# EAGLE design 23138_adapter_passive (EAGLE 9.5.2)
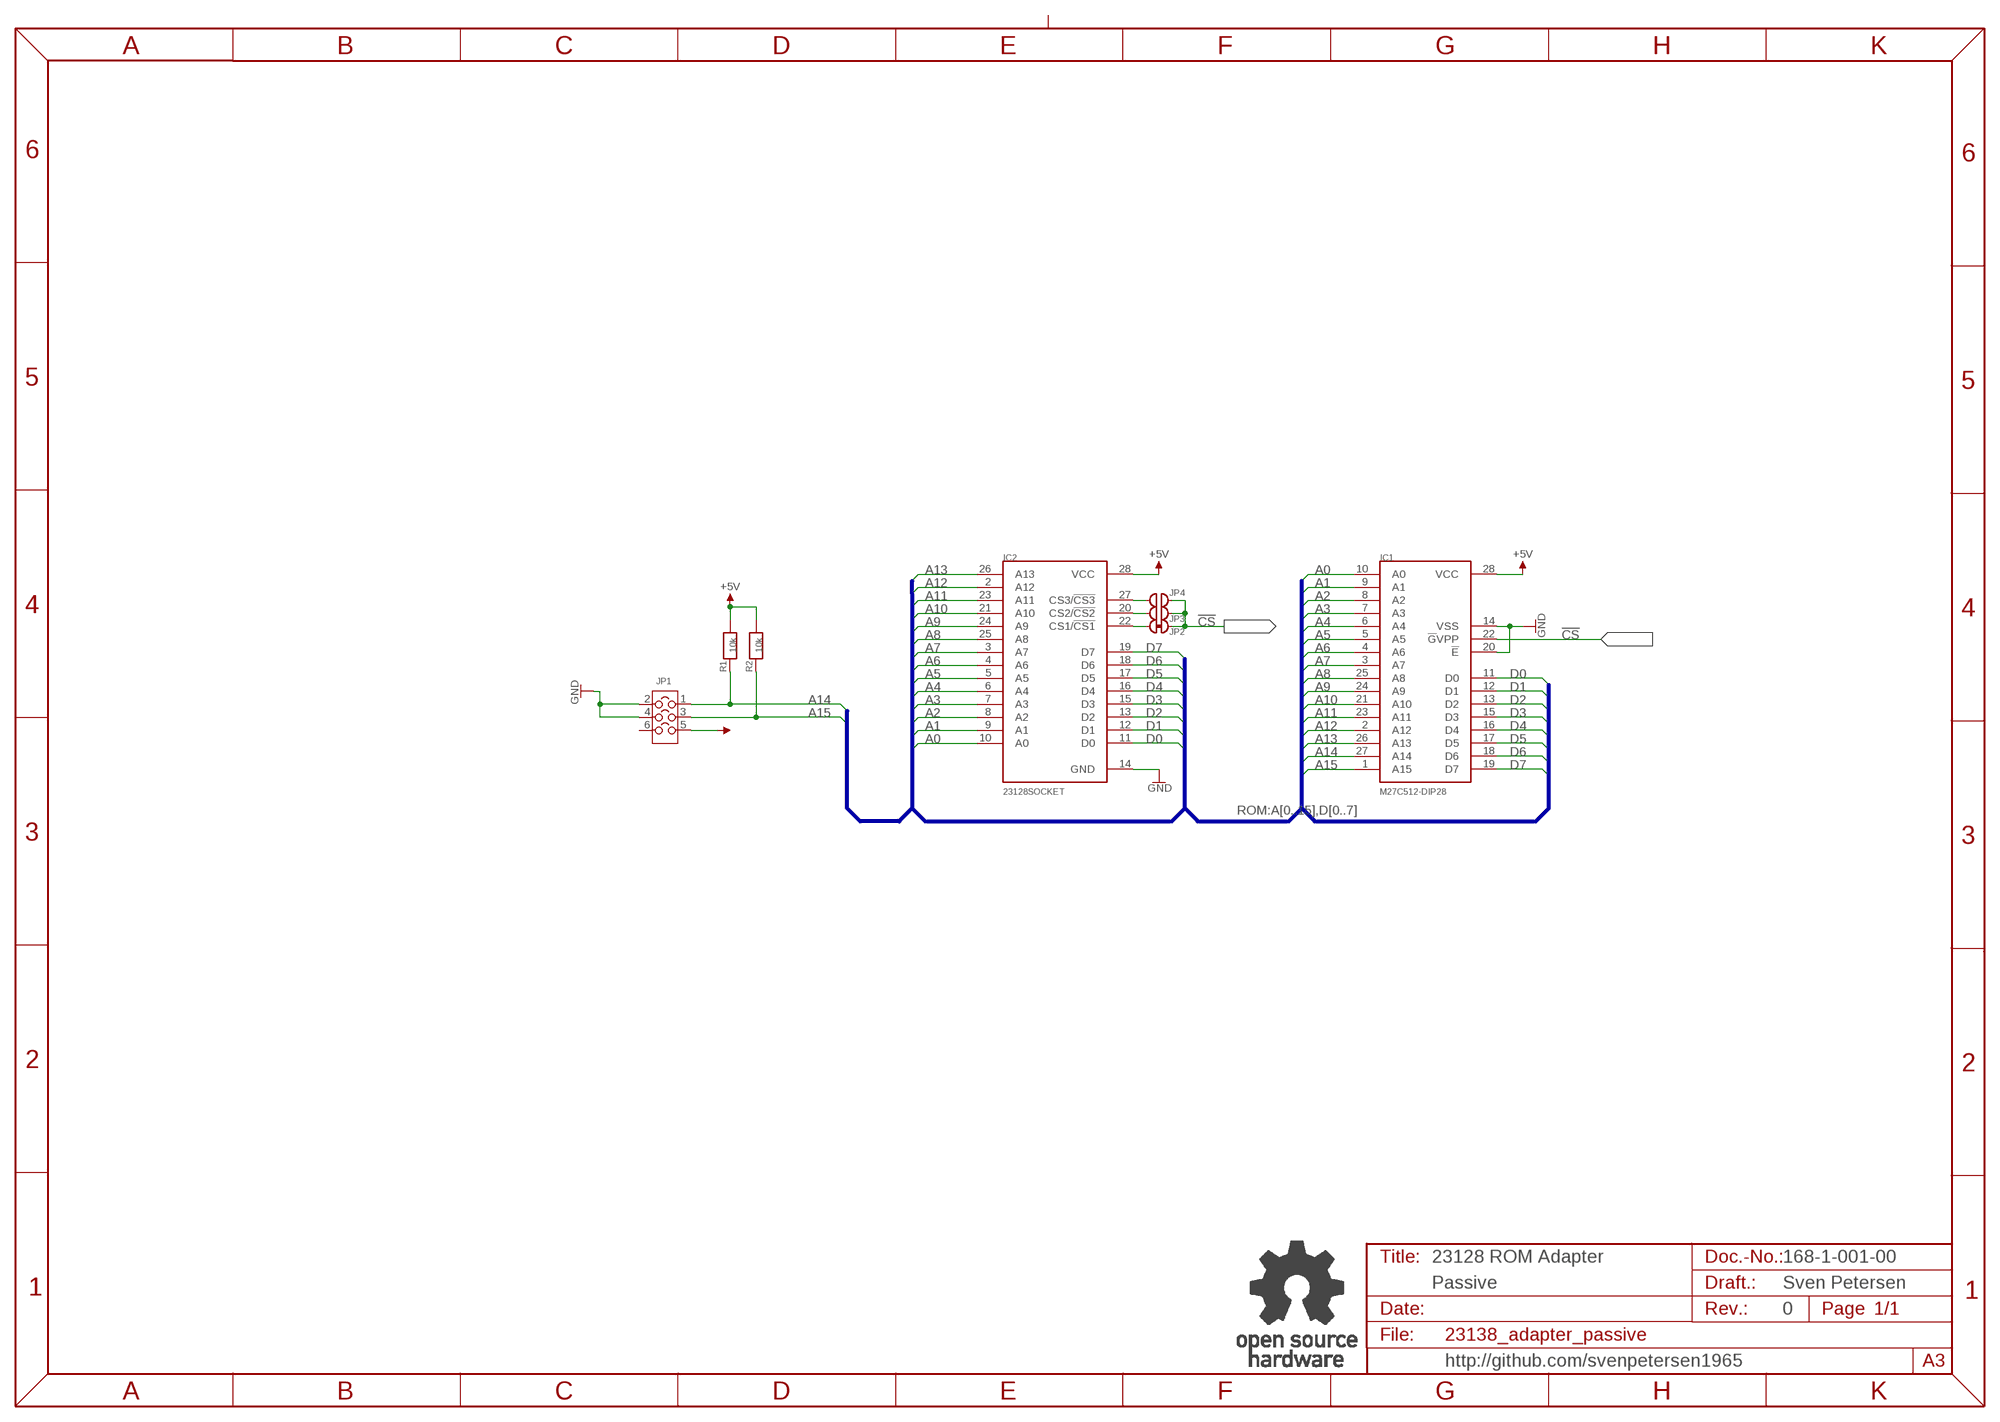
[diagram p0: schematic, sheet 1]

## Parts
IC1  M27C512-DIP28  [DIL28-6]
IC2  23128SOCKET  [DIL28_SOCKET]
JP1  COMBI-3X2P-90°  [COMBI-3X2W]
JP2  CLOSED  [CP_CL]
JP3  OPEN  [CP_OP]
JP4  OPEN  [CP_OP]
R1  10k  R-0805  [0805]
R2  10k  R-0805  [0805]
U$21  OPEN_SOURCE_HW  [OPENHW]

## Nets
!CS: IC1.22(!G!VPP) JP2.2 JP3.2 JP4.2
+5V: IC1.28(VCC) IC2.28(VCC) JP1.5 R1.2 R2.2
A0: IC1.10(A0) IC2.10(A0)
A1: IC1.9(A1) IC2.9(A1)
A2: IC1.8(A2) IC2.8(A2)
A3: IC1.7(A3) IC2.7(A3)
A4: IC1.6(A4) IC2.6(A4)
A5: IC1.5(A5) IC2.5(A5)
A6: IC1.4(A6) IC2.4(A6)
A7: IC1.3(A7) IC2.3(A7)
A8: IC1.25(A8) IC2.25(A8)
A9: IC1.24(A9) IC2.24(A9)
A10: IC1.21(A10) IC2.21(A10)
A11: IC1.23(A11) IC2.23(A11)
A12: IC1.2(A12) IC2.2(A12)
A13: IC1.26(A13) IC2.26(A13)
A14: IC1.27(A14) JP1.1 R1.1
A15: IC1.1(A15) JP1.3 R2.1
D0: IC1.11(D0) IC2.11(D0)
D1: IC1.12(D1) IC2.12(D1)
D2: IC1.13(D2) IC2.13(D2)
D3: IC1.15(D3) IC2.15(D3)
D4: IC1.16(D4) IC2.16(D4)
D5: IC1.17(D5) IC2.17(D5)
D6: IC1.18(D6) IC2.18(D6)
D7: IC1.19(D7) IC2.19(D7)
GND: IC1.14(VSS) IC1.20(!E) IC2.14(GND) JP1.2 JP1.4
N$1: IC2.22(CS1/!CS1) JP2.1
N$2: IC2.27(CS3/!CS3) JP4.1
N$3: IC2.20(CS2/!CS2) JP3.1
Unconnected: JP1.6

## Buses
ROM:A[0..15],D[0..7]

## Notes on the sheet
- 23128 ROM Adapter | 168-1-001-00
- Passive | Sven Petersen
- 0
- http://github.com/svenpetersen1965

## Library data of the parts
IC1 = ST:M27C512
IC2 = MOS:23128
JP1 = Cutpad:COMBI-3X2P
JP2 = Cutpad:CLOSED: Closed Cutpad
JP3 JP4 = Cutpad:OPEN: open Cutpad
R1 R2 = SMD:R-0805
U$21 = Logo:OPEN_SOURCE_HW

## Board
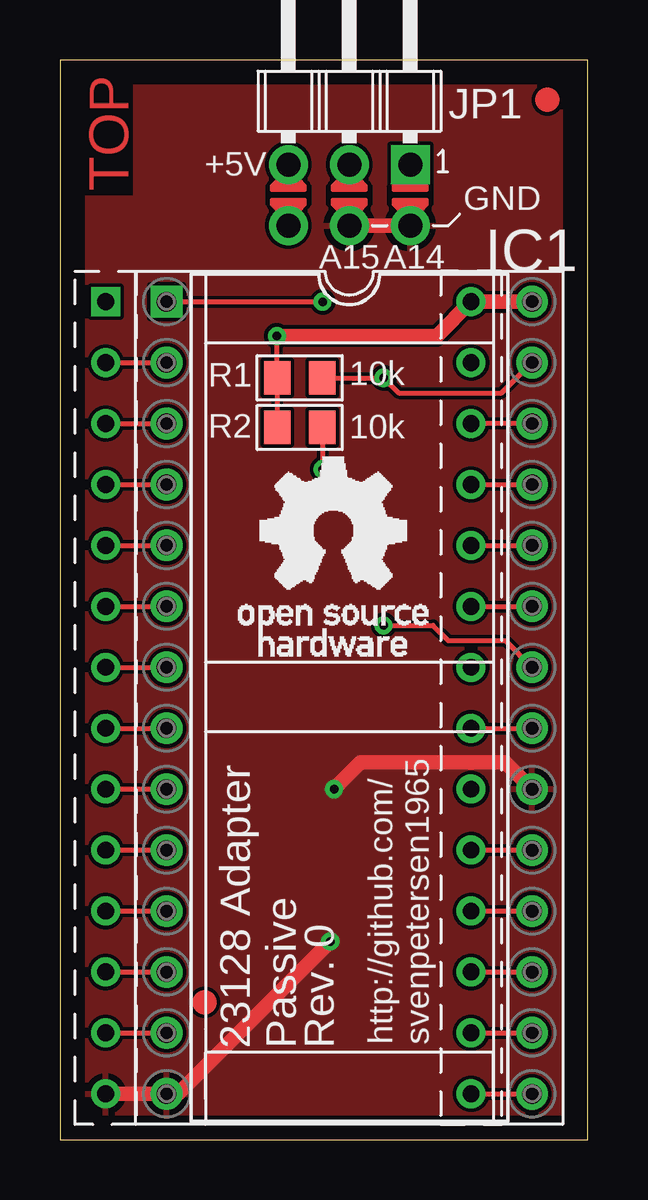
[diagram p1: board, top side]
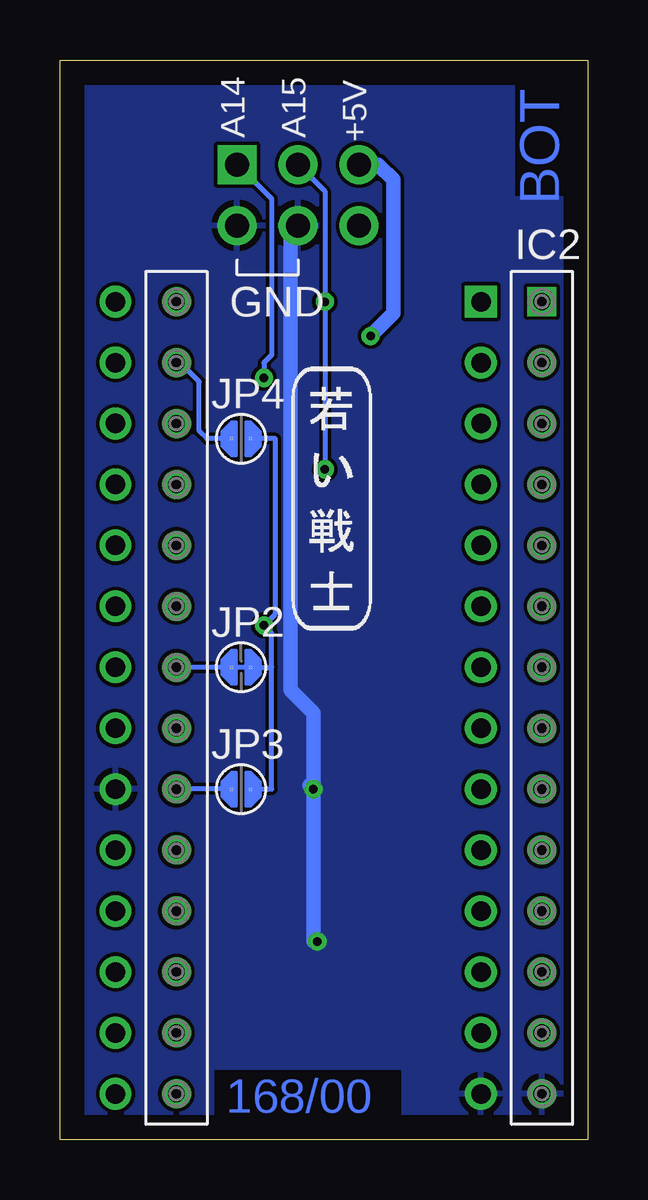
[diagram p2: board, bottom side, seen from below]

Size 22 x 45 mm. Coordinates in mm from the lower left corner, seen from the top.
Outline: 0,0 22,0 22,45 0,45 0,0
Copper layers (1*16): Top 0.035mm / dielectric 1.5mm / Bottom 0.035mm
Design rules "default *": minimum track width 6mil, minimum drill 0.35mm, track to track 6mil, track to pad 6mil, pad to pad 6mil, via to via 6mil, smd to smd 6mil, copper to edge 40mil, drill to drill 6mil, minimum pad ring 10mil, minimum via ring 8mil, stop-mask expansion 4mil, vias tented up to drill 24mil, thermal gap 10mil
bRestrict: 3 lines

### Footprints (pad centres in the part's own frame; a part is rotated, then mirrored left to right if it is on the bottom)
DIL28-6 = drill 0.813 square: 1 -16.51,-7.62 | drill 0.813: 2 -13.97,-7.62; 3 -11.43,-7.62; 4 -8.89,-7.62; 5 -6.35,-7.62; 6 -3.81,-7.62; 7 -1.27,-7.62; 8 1.27,-7.62; 9 3.81,-7.62; 10 6.35,-7.62; 11 8.89,-7.62; 12 11.43,-7.62; 13 13.97,-7.62; 14 16.51,-7.62; 15 16.51,7.62; 16 13.97,7.62; 17 11.43,7.62; 18 8.89,7.62; 19 6.35,7.62; 20 3.81,7.62; 21 1.27,7.62; 22 -1.27,7.62; 23 -3.81,7.62; 24 -6.35,7.62; 25 -8.89,7.62; 26 -11.43,7.62; 27 -13.97,7.62; 28 -16.51,7.62
DIL28_SOCKET = drill 0.7 square: 1 -16.51,-7.62 | drill 0.7: 2 -13.97,-7.62; 3 -11.43,-7.62; 4 -8.89,-7.62; 5 -6.35,-7.62; 6 -3.81,-7.62; 7 -1.27,-7.62; 8 1.27,-7.62; 9 3.81,-7.62; 10 6.35,-7.62; 11 8.89,-7.62; 12 11.43,-7.62; 13 13.97,-7.62; 14 16.51,-7.62; 15 16.51,7.62; 16 13.97,7.62; 17 11.43,7.62; 18 8.89,7.62; 19 6.35,7.62; 20 3.81,7.62; 21 1.27,7.62; 22 -1.27,7.62; 23 -3.81,7.62; 24 -6.35,7.62; 25 -8.89,7.62; 26 -11.43,7.62; 27 -13.97,7.62; 28 -16.51,7.62
COMBI-3X2W = drill 1 pad 1.626 square: 1 -1.27,2.54 | drill 1 pad 1.626: 2 1.27,2.54; 3 -1.27,0; 4 1.27,0; 5 -1.27,-2.54; 6 1.27,-2.54
CP_CL = smd 0.152 x 0.152: 1 -0.4,0; 2 0.4,0
CP_OP = smd 0.152 x 0.152: 1 -0.4,0; 2 0.4,0
0805 = smd 1.092 x 1.397: 1 -0.94,0; 2 0.94,0

### Placement (x,y rotation side)
IC1  12.06,18.41 270 top
IC2  9.53,18.41 270 top
JP1  12.06,39.37 270 top
JP2  14.45,19.68 0 bottom
JP3  14.45,14.61 0 bottom
JP4  14.45,29.21 0 bottom
R1  10,31.75 180 top
R2  10,29.69 180 top
U$16  [GS28P]  12.06,18.41 270 top
U$17  [SMD_REF_R1MM]  20.32,43.34 0 top
U$18  [SMD_REF_R1MM]  6.03,5.71 0 top
U$19  [2LAYER]  2.86,39.53 90 top
U$20  [PCB-TITLE/]  0,58.58 0 top  (outside the outline)
U$21  7.46,20.16 0 top
U$22  [SVEN_TAG]  10.64,26.83 0 bottom

### Tracks (layer width: path | path; a pad name or v marks a point on that pad's centre or on a via)
!CS  (via drill 0.35)
  Top 0.203: v13.49,21.43 15.56,21.43 16.19,20.8 18.57,20.8 IC1.22
  Bottom 0.203: JP2.2 13.18,19.68 | 13.18,19.68 13.18,21.11 v13.49,21.43 13.02,21.91 13.02,29.21 JP4.2 | JP3.2 13.18,14.61 13.18,19.68
+5V  (via drill 0.35)
  Top 0.203: v9.05,33.5 9.06,33.48 R1.2 R2.2
  Top 0.61: IC1.28 IC2.28 15.72,33.5 14.29,33.5 v9.05,33.5
  Bottom 0.61: v9.05,33.5 8.1,34.45 8.1,40.01 8.73,40.64 JP1.5
A0
  Top 0.203: IC2.10 IC1.10
A1
  Top 0.203: IC2.9 IC1.9
A2
  Top 0.203: IC2.8 IC1.8
A3
  Top 0.203: IC2.7 IC1.7
A4
  Top 0.203: IC2.6 IC1.6
A5
  Top 0.203: IC2.5 IC1.5
A6
  Top 0.203: IC2.4 IC1.4
A7
  Top 0.203: IC2.3 IC1.3
A8
  Top 0.203: IC2.25 IC1.25
A9
  Top 0.203: IC2.24 IC1.24
A10
  Top 0.203: IC2.21 IC1.21
A11
  Top 0.203: IC2.23 IC1.23
A12
  Top 0.203: IC2.2 IC1.2
A13
  Top 0.203: IC1.26 IC2.26
A14  (via drill 0.35)
  Top 0.203: IC1.27 18.41,31.11 14.13,31.11 v13.49,31.75 R1.1
  Bottom 0.203: JP1.1 13.18,39.21 13.18,32.7 13.49,32.38 v13.49,31.75
A15  (via drill 0.35)
  Top 0.203: R2.1 10.94,27.95 v10.95,27.94 | IC1.1 v10.95,34.92
  Bottom 0.203: JP1.3 10.95,39.53 v10.95,34.92 v10.95,27.94
D0
  Top 0.203: IC2.11 IC1.11
D1
  Top 0.203: IC2.12 IC1.12
D2
  Top 0.203: IC2.13 IC1.13
D3
  Top 0.203: IC2.15 IC1.15
D4
  Top 0.203: IC2.16 IC1.16
D5
  Top 0.203: IC2.17 IC1.17
D6
  Top 0.203: IC2.18 IC1.18
D7
  Top 0.203: IC2.19 IC1.19
GND  (via drill 0.35)
  Top 0.61: v11.27,8.26 4.92,1.91 IC1.14 IC2.14 | JP1.4 JP1.2 | v11.43,14.61 12.54,15.72 18.57,15.72 IC1.20
  Bottom 0.61: v11.27,8.26 11.43,8.26 v11.43,14.61 11.59,14.76 11.43,14.92 11.43,17.78 12.38,18.73 12.38,37.78 JP1.4
  pour Top: 0.64,0.64 21.27,0.64 21.27,44.13 0.64,44.13
  pour Bottom: 0.64,0.64 21.27,0.64 21.27,44.13 0.64,44.13
N$1
  Bottom 0.203: JP2.1 IC2.22
N$2
  Bottom 0.203: JP4.1 15.88,29.21 16.19,29.53 16.19,31.59 16.99,32.38 IC2.27
N$3
  Bottom 0.203: JP3.1 IC2.20

### Text on the board
Bottom: 168/00
tPlace: +5V | GND | A15 | A14 | 10k | 10k | 23128 Adapter / Passive | Rev. 0 | http://github.com/ / svenpetersen1965
bPlace: +5V | A15 | A14 | GND
Document: Sven Petersen | 168-2-01-00 | 2020 | 35µm | 2 | 0